# EAGLE schematic Схема платы (EAGLE 9.4.2)
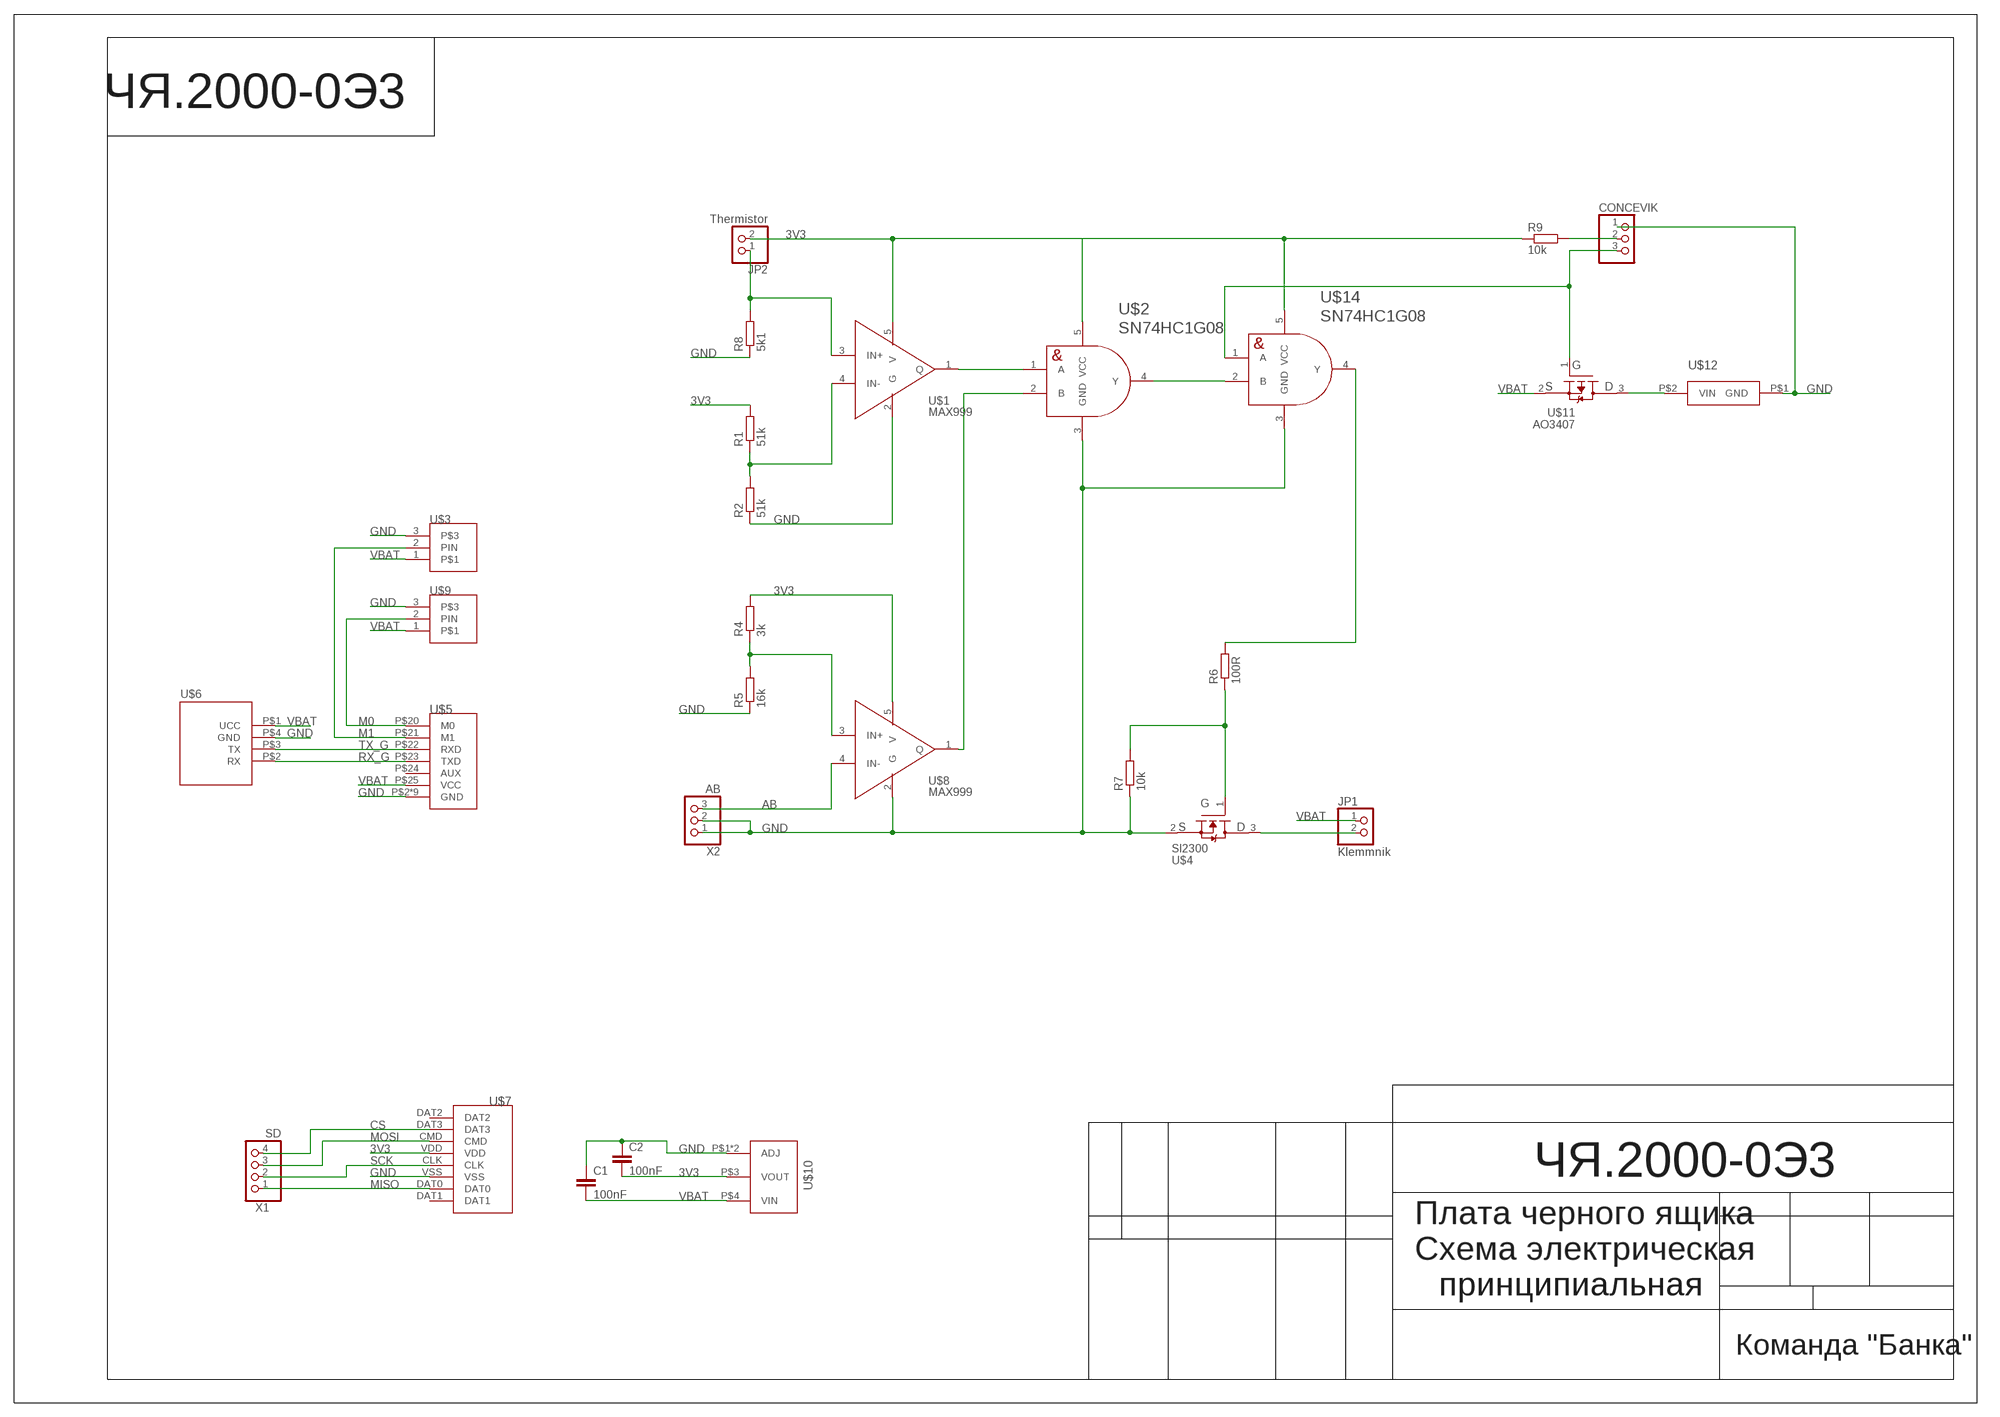
[diagram p0: schematic, sheet 1]

## Parts
C1  100nF  C-EUC0603  [C0603]
C2  100nF  C-EUC0603  [C0603]
CONCEVIK  PINHD-1X3  [1X03]
JP1  Klemmnik  PINHD-1X2  [1X02]
JP2  Thermistor  PINHD-1X2  [1X02]
R1  51k  R-EU_R0603  [R0603]
R2  51k  R-EU_R0603  [R0603]
R4  3k  R-EU_R0603  [R0603]
R5  16k  R-EU_R0603  [R0603]
R6  100R  R-EU_R0603  [R0603]
R7  10k  R-EU_R0603  [R0603]
R8  5k1  R-EU_R0603  [R0603]
R9  10k  R-EU_R0603  [R0603]
U$1  MAX999  [SOT23-5]
U$2  SN74HC1G08  [SOT23-5]
U$3  CONNECT_3  [CONNECT_3]
U$4  SI2300  [SOT23-3]
U$5  E220-400T22S  [E220-400T22S]
U$6  GPS-NEO7M  [GPS-NEO7M]
U$7  SD  [SD]
U$8  MAX999  [SOT23-5]
U$9  CONNECT_3  [CONNECT_3]
U$10  AMS1117  [SOT223]
U$11  AO3407  [SOT23-3]
U$12  BUZZERS8R6  [BUZZER-S8R12]
U$14  SN74HC1G08  [SOT23-5]
X1  SD  PINHD-1X4  [1X04]
X2  AB  PINHD-1X3  [1X03]

## Nets
3V3: C2.2 JP2.2 R1.2 R4.2 R9.2 U$1.5(V) U$2.5(VCC) U$7.VDD U$8.5(V) U$10.P$3(VOUT) U$14.5(VCC)
AB: U$8.4(IN-) X2.3
CS: U$7.DAT3 X1.4
GND: C1.1 C2.1 CONCEVIK.1 R2.1 R5.1 R7.1 R8.1 U$1.2(G) U$2.3(GND) U$3.3 U$4.2(NS) U$5.P$2(GND) U$5.P$8(GND) U$5.P$11(GND) U$5.P$13(GND) U$5.P$14(GND) U$5.P$15(GND) U$5.P$16(GND) U$5.P$19(GND) U$5.P$26(GND) U$6.P$4(GND) U$7.VSS U$8.2(G) U$9.3 U$10.P$1(ADJ) U$10.P$2(ADJ) U$12.P$1(GND) U$14.3(GND) X2.1 X2.2
M0: U$5.P$20(M0) U$9.2(PIN)
M1: U$3.2(PIN) U$5.P$21(M1)
MISO: U$7.DAT0 X1.1
MOSI: U$7.CMD X1.3
N$1: JP2.1 R8.2 U$1.3(IN+)
N$2: CONCEVIK.2 R9.1
N$3: R4.1 R5.2 U$8.3(IN+)
N$8: R1.1 R2.2 U$1.4(IN-)
N$9: U$1.1(Q) U$2.1(A)
N$10: U$2.2(B) U$8.1(Q)
N$11: JP1.2 U$4.3(ND)
N$12: U$2.4(Y) U$14.2(B)
N$13: R6.1 R7.2 U$4.1(NG)
N$14: U$11.3(PD) U$12.P$2(VIN)
N$15: CONCEVIK.3 U$11.1(PG) U$14.1(A)
N$17: R6.2 U$14.4(Y)
RX_G: U$5.P$23(TXD) U$6.P$2(RX)
SCK: U$7.CLK X1.2
TX_G: U$5.P$22(RXD) U$6.P$3(TX)
VBAT: C1.2 JP1.1 U$3.1 U$5.P$25(VCC) U$6.P$1(UCC) U$9.1 U$10.P$4(VIN) U$11.2(PS)
Unconnected: U$5.P$24(AUX) U$7.DAT1 U$7.DAT2

## Notes on the sheet
- ЧЯ.2000-0Э3
- ЧЯ.2000-0Э3
- Плата черного ящика
- Схема электрическая
- принципиальная
- Команда "Банка"

## Library data of the parts
C1 C2 = rcl:C-EU: CAPACITOR, European symbol; SPICEPREFIX: C
CONCEVIK X2 = pinhead:PINHD-1X3: PIN HEADER
JP1 JP2 = pinhead:PINHD-1X2: PIN HEADER
R1 R2 R4-R9 = rcl:R-EU_: RESISTOR, European symbol; SPICEPREFIX: R
U$1 U$8 = Banka-2026:MAX999
U$2 U$14 = Banka-2026:SN74HC1G08
U$3 U$9 = UNKNOWN-2024:CONNECT_3
U$4 = Banka-2026:SI2300
U$5 = UNKNOWN-2024:E220-400T22S
U$6 = UNKNOWN-2024:GPS-NEO7M
U$7 = UNKNOWN-2024:SD
U$10 = CanCubeSat:AMS1117
U$11 = Banka-2026:AO3407
U$12 = Banka-2026:BUZZER
X1 = pinhead:PINHD-1X4: PIN HEADER